# EAGLE design SMD_Soldering_Board (EAGLE 8.4.1)
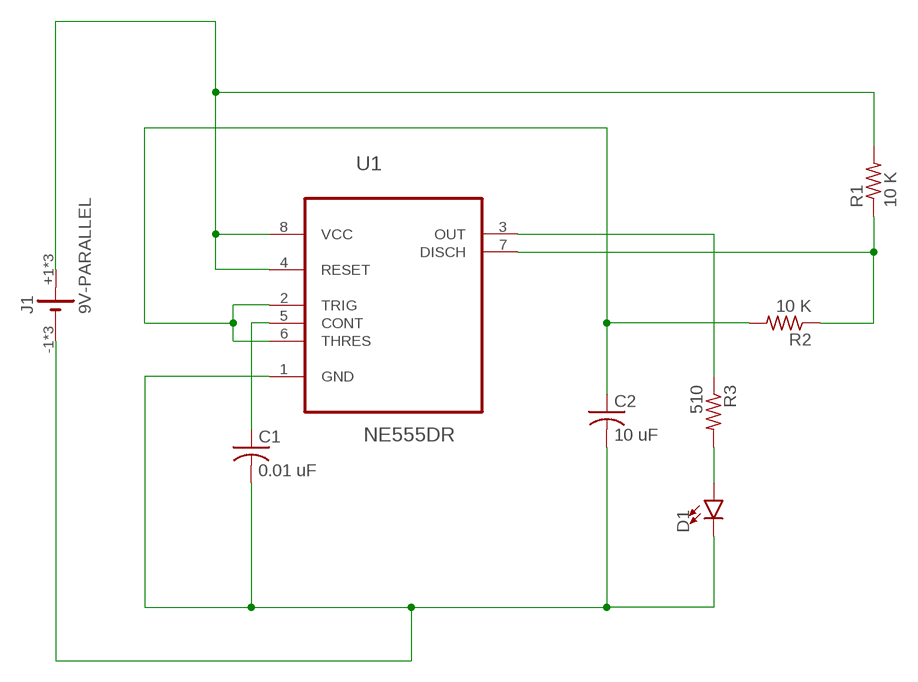
[diagram p0: schematic, sheet 1]

## Parts
C1  0.01 uF  C-USC0603  [C0603]
C2  10 uF  C-USC0603  [C0603]
D1  LED0603  [LED-0603]
J1  9V-PARALLEL  [9V-PARALLEL-CLIP]
R1  10 K  R-US_R0603  [R0603]
R2  10 K  R-US_R0603  [R0603]
R3  510  R-US_R0603  [R0603]
U1  NE555DR  [SOIC127P600X175-8N]

## Nets
9V: J1.+1(+) J1.+2(+) J1.+3(+) R1.2 U1.4(RESET) U1.8(VCC)
GND: C1.2 C2.2 D1.C J1.-1(-) J1.-2(-) J1.-3(-) U1.1(GND)
N$1: C2.1 R2.2 U1.2(TRIG) U1.6(THRES)
N$4: R1.1 R2.1 U1.7(DISCH)
N$5: R3.1 U1.3(OUT)
N$6: C1.1 U1.5(CONT)
N$7: D1.A R3.2

## Library data of the parts
C1 C2 = adafruit:C-US: CAPACITOR, American symbol
D1 = SparkFun-LED:LED: LED (Generic) Standard schematic elements and footprints for 5mm, 3mm, 1206, and 0603 sized LEDs. Generic LEDs with no color specified.
J1 = battery2:9V-PARALLEL
R1-R3 = adafruit:R-US_: RESISTOR, American symbol
U1 = Texas Instruments_By_element14_Batch_1:NE555DR: PRECISION TIMERS; MPN: NE555DR; OC_FARNELL: 7527482; OC_NEWARK: 75C4440; PACKAGE: SOIC-8; SUPPLIER: Texas Instruments

## Board
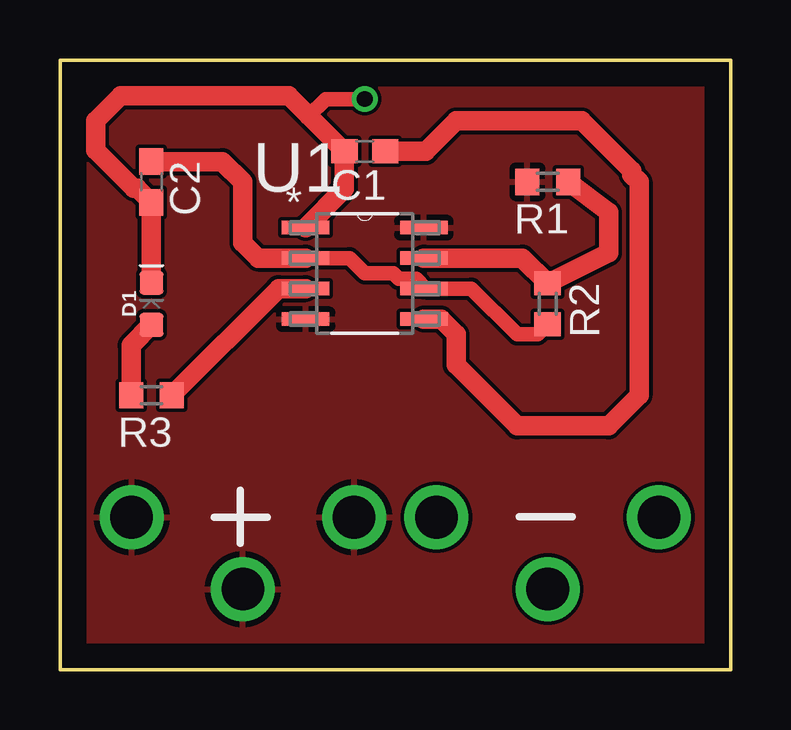
[diagram p1: board, top side]
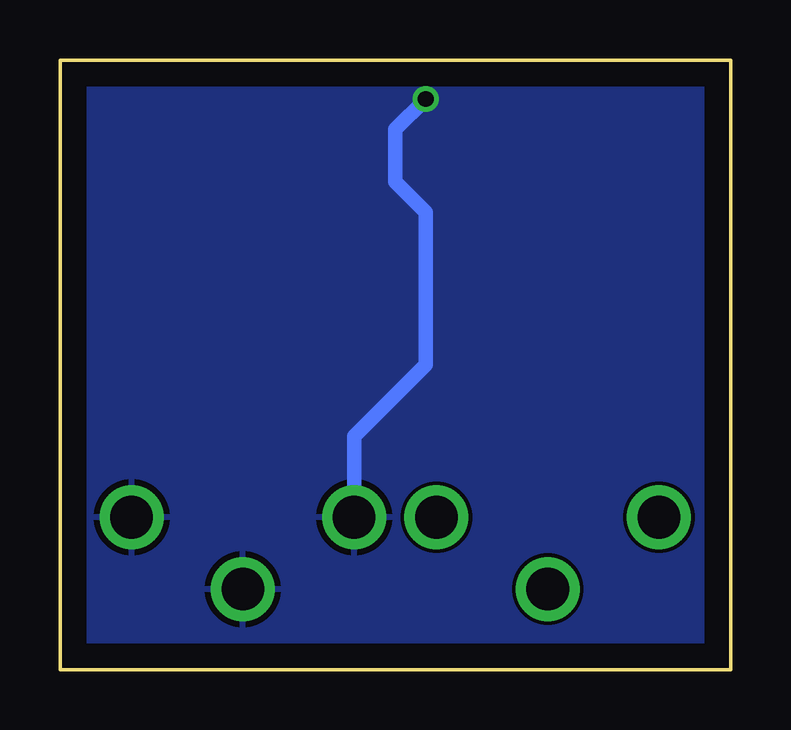
[diagram p2: board, bottom side, seen from below]

Size 27.94 x 25.4 mm. Coordinates in mm from the lower left corner, seen from the top.
Outline: 0,0 27.94,0 27.94,25.4 0,25.4 0,0
Copper layers (1*16): Top 0.035mm / dielectric 1.5mm / Bottom 0.035mm
Design rules "default": minimum track width 6mil, minimum drill 0.35mm, track to track 6mil, track to pad 6mil, pad to pad 6mil, via to via 6mil, smd to smd 6mil, copper to edge 40mil, drill to drill 6mil, minimum pad ring 10mil, minimum via ring 8mil, stop-mask expansion 4mil, vias tented up to drill 0mil, thermal gap 10mil

### Footprints (pad centres in the part's own frame; a part is rotated, then mirrored left to right if it is on the bottom)
C0603 = smd 1.1 x 1: 1 -0.85,0; 2 0.85,0
LED-0603 = smd 1 x 1: A -0.877,0; C 0.877,0
9V-PARALLEL-CLIP = drill 1.778: +1 -10.986,0; +2 -6.35,-2.997; +3 -1.714,0; -1 1.714,0; -2 6.35,-2.997; -3 10.986,0
R0603 = smd 1 x 1.1: 1 -0.85,0; 2 0.85,0
SOIC127P600X175-8N = smd 1.981 x 0.559: 1 -2.464,1.905; 2 -2.464,0.635; 3 -2.464,-0.635; 4 -2.464,-1.905; 5 2.464,-1.905; 6 2.464,-0.635; 7 2.464,0.635; 8 2.464,1.905

### Placement (x,y rotation side)
C1  12.7,21.59 180 top
C2  3.81,20.32 270 top
D1  3.81,15.24 90 top
J1  13.97,6.35 0 top
R1  20.32,20.32 180 top
R2  20.32,15.24 270 top
R3  3.81,11.43 180 top
U1  12.7,16.51 0 top

### Tracks (layer width: path | path; a pad name or v marks a point on that pad's centre or on a via)
9V
  pour Top: 0,0 27.94,0 27.94,25.4 0,25.4
GND  (via drill 0.66)
  Top 0.61: v12.7,23.77 11.07,23.77 10.37,23.07
  Top 0.813: U1.1 11.85,20.03 C1.2 10.37,23.07 9.54,23.9 2.54,23.9 1.5,22.86 1.5,21.64 3.08,20.06 3.22,20.06 C2.2 D1.C
  Bottom 0.61: J1.-1 15.68,9.72 12.7,12.7 12.7,19.05 13.97,20.32 13.97,22.5 v12.7,23.77
  pour Bottom: 0,0 27.94,0 27.94,25.4 0,25.4
N$1
  Top 0.61: 15.24,15.88 U1.6 | 15.24,15.88 17.14,15.88 19.05,13.97 19.9,13.97 R2.2 | U1.2 12.06,17.14 12.7,16.51 13.88,16.51 14.11,16.28 14.83,16.28 15.24,15.88
  Top 0.813: C2.1 6.77,21.17 7.62,20.32 7.62,17.78 8.26,17.14 U1.2
N$4
  Top 0.813: U1.7 19.27,17.14 R2.1 22.86,17.36 22.86,19.05 R1.1
N$5
  Top 0.813: R3.1 9.11,15.88 U1.3
N$6
  Top 0.813: C1.1 15.24,21.59 16.51,22.86 21.74,22.86 23.82,20.77 23.82,20.62 24.13,20.32 24.13,11.43 22.86,10.16 19.05,10.16 16.51,12.7 16.51,13.97 15.88,14.61 U1.5
N$7
  Top 0.813: D1.A 2.96,13.51 R3.2